# Altium schematic sheet Electron.SchDoc
size A3
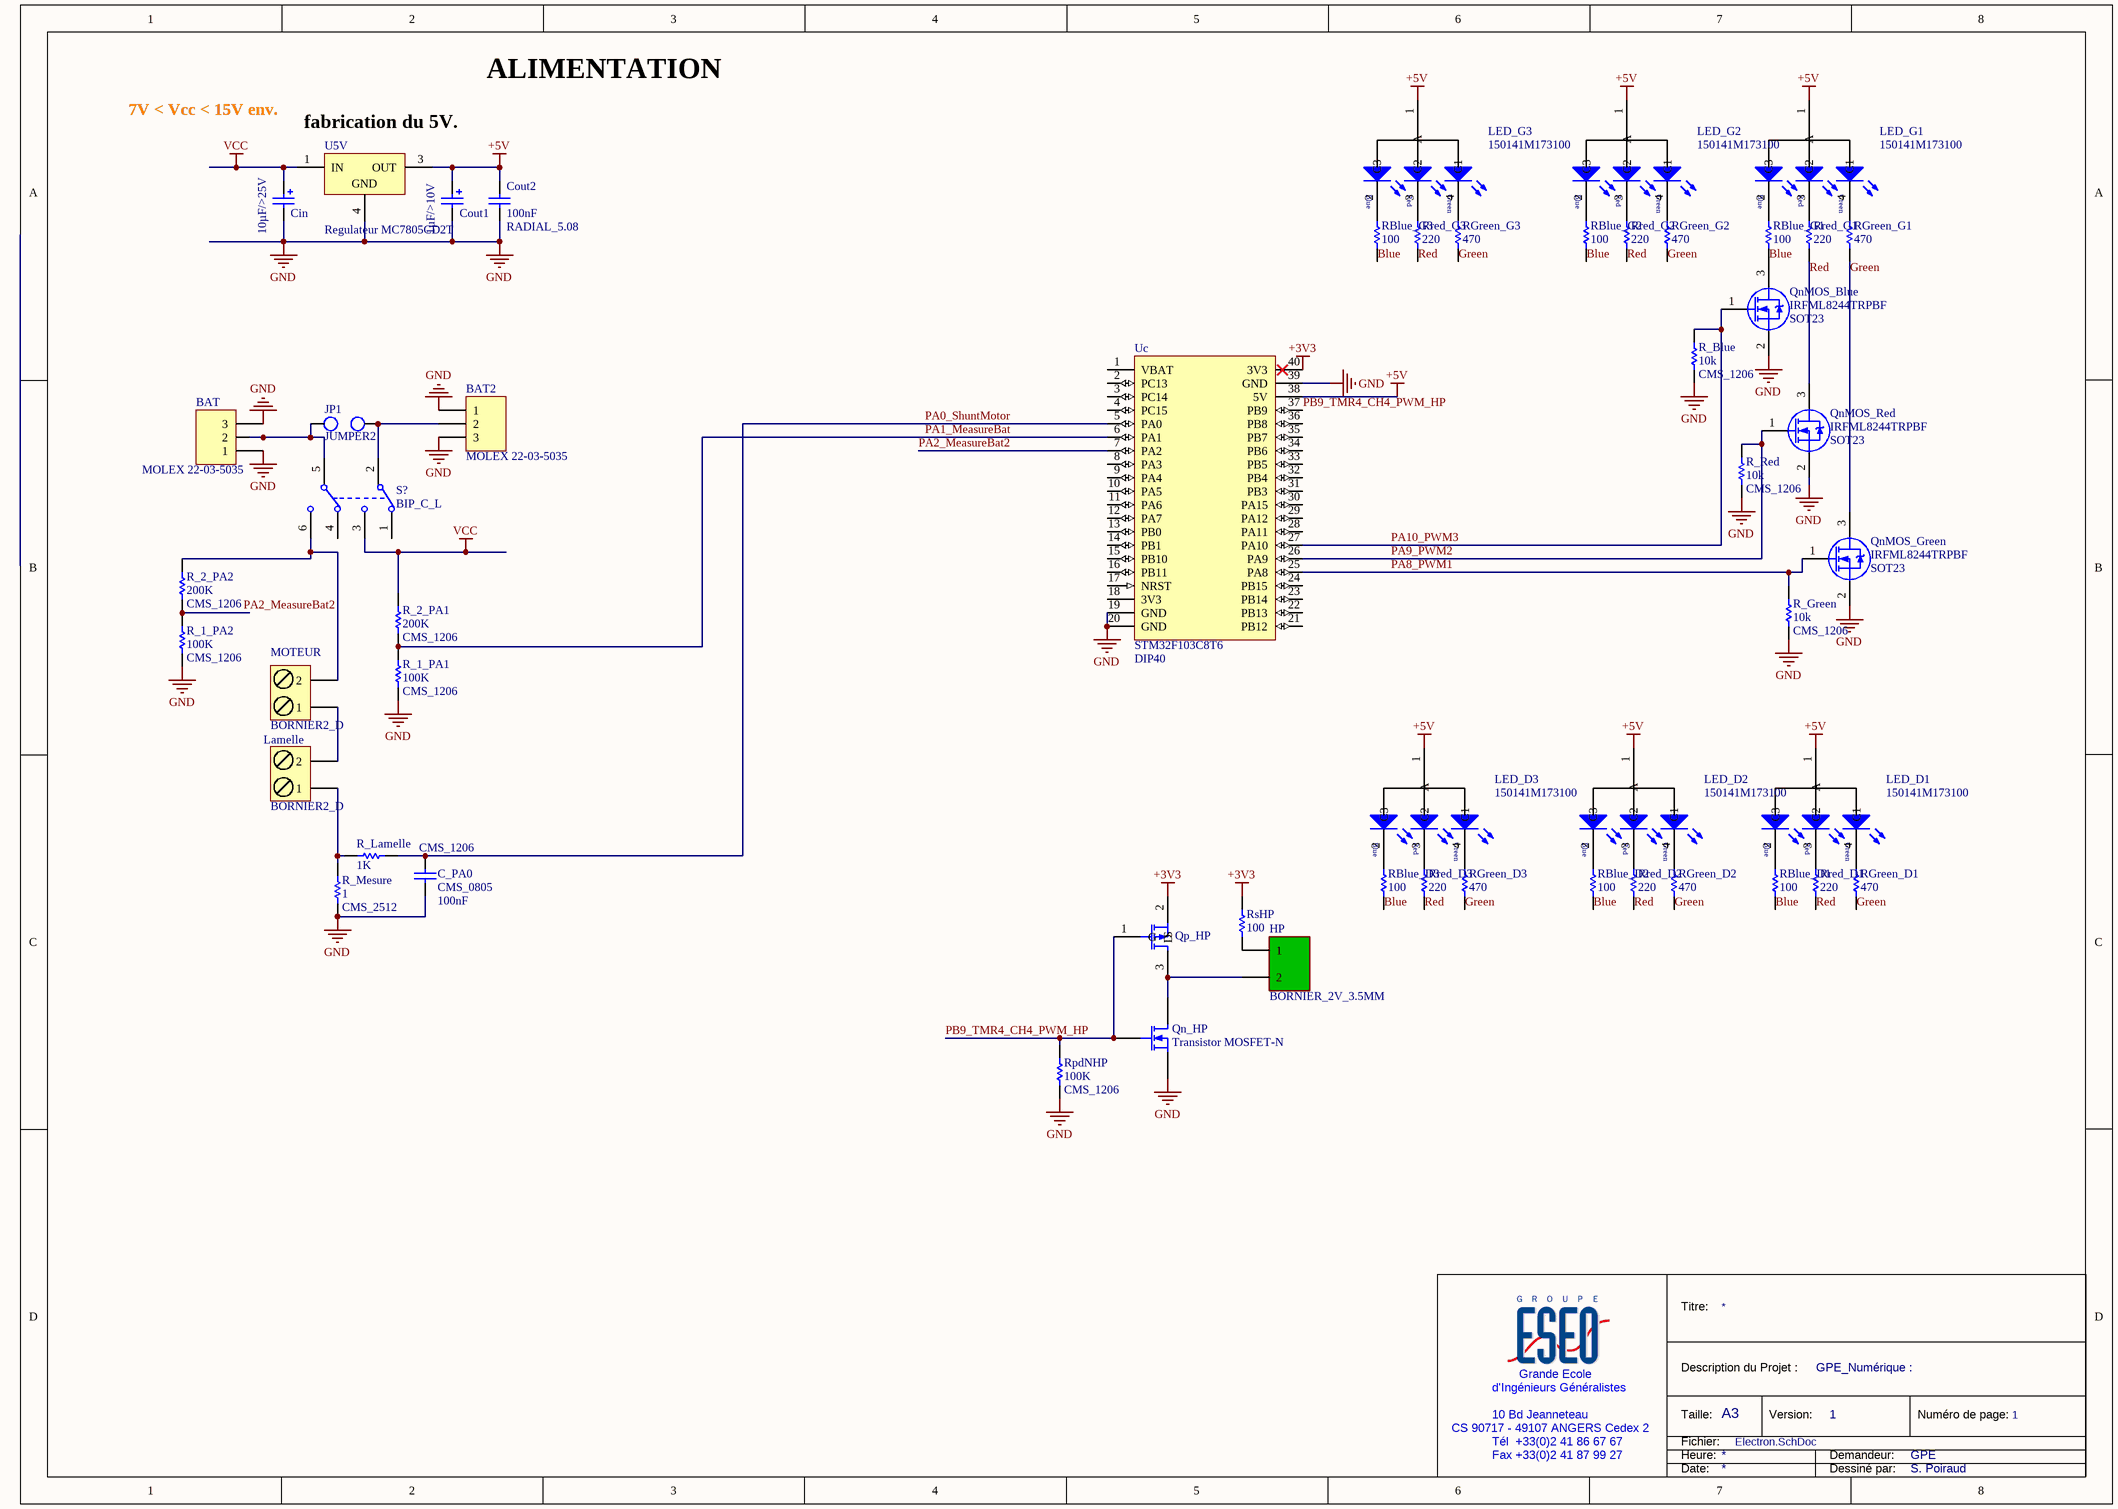
[diagram p0: Electron.SchDoc]

## Parts
BAT  MOLEX 22-03-5035  [MOLEX3_2.5MM]
BAT2  MOLEX 22-03-5035  [MOLEX3_2.5MM]
C_PA0  value 100nF  [C0805_N]  (hidden comment: CMS_0805)
Cin  value 10µF/>25V  [C1206_N]  (hidden comment: CONDENSATEUR_POL_ELECTROLY_RAD_2.0/5.08)
Cout1  value 1µF/>10V  [C1206_N]  (hidden comment: CONDENSATEUR_POL_ELECTROLY_RAD_2.0/5.08)
Cout2  value 100nF  Type: RADIAL_5.08  [C1206_N]  (hidden comment: CONDENSATEUR_CER_RAD_5.08)
HP  BORNIER_2V_3.5MM  [BORNIER_2V_3.5MM]
JP1  JUMPER2  [BARRETTE_2_M_D]
Lamelle  Type: BORNIER2_D  [BORNIER2_A_VIS]  (hidden comment: BORNIER2 DROIT A VIS)
LED_D1  150141M173100  [3528]
LED_D2  150141M173100  [3528]
LED_D3  150141M173100  [3528]
LED_G1  150141M173100  [3528]
LED_G2  150141M173100  [3528]
LED_G3  150141M173100  [3528]
MOTEUR  Type: BORNIER2_D  [BORNIER2_A_VIS]  (hidden comment: BORNIER2 DROIT A VIS)
Qn_HP  Transistor MOSFET-N  [SOT23-3N]
QnMOS_Blue  Type: IRFML8244TRPBF  Package: SOT23  [TRANSISTOR_MOSFET-N_SOT23_GSD]  (hidden comment: TRANSISTOR_MOSFET-N_SOT23_GSD)
QnMOS_Green  Type: IRFML8244TRPBF  Package: SOT23  [TRANSISTOR_MOSFET-N_SOT23_GSD]  (hidden comment: TRANSISTOR_MOSFET-N_SOT23_GSD)
QnMOS_Red  Type: IRFML8244TRPBF  Package: SOT23  [TRANSISTOR_MOSFET-N_SOT23_GSD]  (hidden comment: TRANSISTOR_MOSFET-N_SOT23_GSD)
Qp_HP  Transistor MOSFET-P  [SOT23-3N]  (value not drawn)
R_1_PA1  value 100K  Type: CMS_1206  [R1206_N]  (hidden comment: RESISTANCE_CMS_1206)
R_1_PA2  value 100K  Type: CMS_1206  [R1206_N]  (hidden comment: RESISTANCE_CMS_1206)
R_2_PA1  value 200K  Type: CMS_1206  [R1206_N]  (hidden comment: RESISTANCE_CMS_1206)
R_2_PA2  value 200K  Type: CMS_1206  [R1206_N]  (hidden comment: RESISTANCE_CMS_1206)
R_Blue  value 10k  Type: CMS_1206  [R1206_N]  (hidden comment: RESISTANCE_CMS_1206)
R_Green  value 10k  Type: CMS_1206  [R1206_N]  (hidden comment: RESISTANCE_CMS_1206)
R_Lamelle  value 1K  Type: CMS_1206  [R1206_N]  (hidden comment: RESISTANCE_CMS_1206)
R_Mesure  value 1  Type: CMS_2512  [INDUCTANCE_CMS_1812]  (hidden comment: RESISTANCE_CMS_1206)
R_Red  value 10k  Type: CMS_1206  [R1206_N]  (hidden comment: RESISTANCE_CMS_1206)
RBlue_D1  100  [R1206_N]
RBlue_D2  100  [R1206_N]
RBlue_D3  100  [R1206_N]
RBlue_G1  100  [R1206_N]
RBlue_G2  100  [R1206_N]
RBlue_G3  100  [R1206_N]
RGreen_D1  470  [R1206_N]
RGreen_D2  470  [R1206_N]
RGreen_D3  470  [R1206_N]
RGreen_G1  470  [R1206_N]
RGreen_G2  470  [R1206_N]
RGreen_G3  470  [R1206_N]
RpdNHP  value 100K  Type: CMS_1206  [R1206_N]  (hidden comment: RESISTANCE_CMS_1206)
Rred_D1  220  [R1206_N]
Rred_D2  220  [R1206_N]
Rred_D3  220  [R1206_N]
Rred_G1  220  [R1206_N]
Rred_G2  220  [R1206_N]
Rred_G3  220  [R1206_N]
RsHP  value 100  [R1206_N]  (hidden comment: RESISTANCE_CMS_1206)
S?  Type: BIP_C_L  [INTER_BIPOL_COUD_LEVIERGD]  (hidden comment: INTERRUPTEUR_BIPOLAIRE_COUDE_A_LEVIER)
U5V  Regulateur MC7805CD2T  [D2Pak (134)]
Uc  Type: STM32F103C8T6  Package: DIP40  [STM32F103C8T6_DIP40]  (hidden comment: STM32F103C8T6/PCB_DIP40)

## Nets
+3V3: Qp_HP.2(S) RsHP.2 Uc.40(3V3)
+5V: Cout1.1 Cout2.2 LED_D1.1(A) LED_D2.1(A) LED_D3.1(A) LED_G1.1(A) LED_G2.1(A) LED_G3.1(A) U5V.3(OUT) Uc.38(5V)
GND: BAT.1 BAT.3 BAT2.1 BAT2.3 C_PA0.1 Cin.2 Cout1.2 Cout2.1 Qn_HP.2(S) QnMOS_Blue.2(S) QnMOS_Green.2(S) QnMOS_Red.2(S) R_1_PA1.1 R_1_PA2.1 R_Blue.1 R_Green.2 R_Mesure.1 R_Red.2 RpdNHP.1 U5V.4(GND) Uc.19(GND) Uc.20(GND) Uc.39(GND)
VCC: Cin.1 R_2_PA1.2 S?.3 U5V.1(IN)
Blue: QnMOS_Blue.3(D) RBlue_D1.1 RBlue_D2.1 RBlue_D3.1 RBlue_G1.1 RBlue_G2.1 RBlue_G3.1
Green: QnMOS_Green.3(D) RGreen_D1.1 RGreen_D2.1 RGreen_D3.1 RGreen_G1.1 RGreen_G2.1 RGreen_G3.1
PA0_ShuntMotor: C_PA0.2 R_Lamelle.2 Uc.5(PA0)
PA1_MeasureBat: R_1_PA1.2 R_2_PA1.1 Uc.6(PA1)
PA2_MeasureBat2: R_1_PA2.2 R_2_PA2.1 Uc.7(PA2)
PA8_PWM1: QnMOS_Green.1(G) R_Green.1 Uc.25(PA8)
PA9_PWM2: QnMOS_Red.1(G) R_Red.1 Uc.26(PA9)
PA10_PWM3: QnMOS_Blue.1(G) R_Blue.2 Uc.27(PA10)
PB9_TMR4_CH4_PWM_HP: Qn_HP.1(G) Qp_HP.1(G) RpdNHP.2 Uc.37(PB9)
Red: QnMOS_Red.3(D) Rred_D1.1 Rred_D2.1 Rred_D3.1 Rred_G1.1 Rred_G2.1 Rred_G3.1
NetBAT2_2: BAT2.2 JP1.2 S?.2
NetBAT_2: BAT.2 JP1.1 S?.5
NetHP_1: HP.1 RsHP.1
NetHP_2: HP.2 Qn_HP.3(D) Qp_HP.3(D)
NetLamelle_1: Lamelle.1 R_Lamelle.1 R_Mesure.2
NetLamelle_2: Lamelle.2 MOTEUR.1
NetLED_D1_2: LED_D1.2(C3) RBlue_D1.2
NetLED_D1_3: LED_D1.3(C2) Rred_D1.2
NetLED_D1_4: LED_D1.4(C1) RGreen_D1.2
NetLED_D2_2: LED_D2.2(C3) RBlue_D2.2
NetLED_D2_3: LED_D2.3(C2) Rred_D2.2
NetLED_D2_4: LED_D2.4(C1) RGreen_D2.2
NetLED_D3_2: LED_D3.2(C3) RBlue_D3.2
NetLED_D3_3: LED_D3.3(C2) Rred_D3.2
NetLED_D3_4: LED_D3.4(C1) RGreen_D3.2
NetLED_G1_2: LED_G1.2(C3) RBlue_G1.2
NetLED_G1_3: LED_G1.3(C2) Rred_G1.2
NetLED_G1_4: LED_G1.4(C1) RGreen_G1.2
NetLED_G2_2: LED_G2.2(C3) RBlue_G2.2
NetLED_G2_3: LED_G2.3(C2) Rred_G2.2
NetLED_G2_4: LED_G2.4(C1) RGreen_G2.2
NetLED_G3_2: LED_G3.2(C3) RBlue_G3.2
NetLED_G3_3: LED_G3.3(C2) Rred_G3.2
NetLED_G3_4: LED_G3.4(C1) RGreen_G3.2
NetMOTEUR_2: MOTEUR.2 R_2_PA2.2 S?.6

Not connected (* = marked no-connect by the designer): S? 1 4; Uc 1(VBAT) 2(PC13) 3(PC14) 4(PC15) 8(PA3) 9(PA4) 10(PA5) 11(PA6) 12(PA7) 13(PB0) 14(PB1) 15(PB10) 16(PB11) 17(NRST) 18(3V3) 21(PB12) 22(PB13) 23(PB14) 24(PB15) 28(PA11) 29(PA12) 30(PA15) 31(PB3) 32(PB4) 33(PB5) 34(PB6) 35(PB7) 36(PB8)

## Notes on the sheet
- ALIMENTATION
- 7V < Vcc < 15V env.
- (near U5V) fabrication du 5V.
- Titre:
- d'Ingénieurs Généralistes
- Grande Ecole
- Description du Projet :
- GPE_Numérique :
- CS 90717 - 49107 ANGERS Cedex 2
- 10 Bd Jeanneteau
- Tél  +33(0)2 41 86 67 67
- Fax +33(0)2 41 87 99 27
- Taille:
- Heure:
- Fichier:
- A3
- Version:
- 1
- Demandeur:
- GPE
- Numéro de page:
- Date:
- Dessiné par:
- S. Poiraud
- (in symbol WL-SFTW 3528 150141M173100) Blue; Red; Green

## Library data of the parts
BAT BAT2 = BARRETTE3: Header, 3-Pin; LatestRevisionDate: 17-Jul-2002; LatestRevisionNote: Re-released for DXP Platform.; Publisher: Altium Limited
C_PA0 = CONDENSATEUR_CMS_CER_0805: CONDENSATEUR CMS CERAMIQUE 0805; Type: CMS_0805
Cin Cout1 = CONDENSATEUR_POL_ELECTROLY_RAD_2.0/5.08: CONDENSATEUR POLARISE ELECTROLYTIQUE RADIAL 2.0/5.08; Type: POL_RAD_2.0/5.08
Cout2 = CONDENSATEUR_CER_RAD_5.08: CONDENSATEUR TRAVERSANT CERAMIQUE RADIAL 5.08mm
JP1 = JUMPER2: BARRETTE 2 CONTACTS 1 RANGEE MALE DROITE; Type: JUMPER2
Lamelle MOTEUR = BORNIER2_DROIT_A VIS: BORNIER 2 PLOTS DROIT A VIS 5.08mm
LED_D1-LED_D3 LED_G1-LED_G3 = WL-SFTW 3528 150141M173100: SMD Full-Color Top LED, WL-SFTW, Red & Green & Blue; Manufacturer: Würth Elektronik eiSos GmbH; PartNo: 150141M173100; ComponentLink1Description: Manufacturer; ComponentLink1URL: http://www.we-online.de; Created by: Christin Otto; Created Date: June 2013; ComponentLink2Description: Datasheet; ComponentLink2URL: http://katalog.we-online.com/led/datasheet/150141M173100.pdf; Color: Red & Green & Blue
Qn_HP = Transistor MOSFET-N: N-Channel MOSFET; PackageDocument: 1995/1996; Published: 8-Jun-2000; LatestRevisionDate: 17-Jul-2002; LatestRevisionNote: Re-released for DXP Platform.; PackageReference: E3; Publisher: Altium Limited
QnMOS_Blue QnMOS_Green QnMOS_Red = TRANSISTOR_MOSFET-N_SOT23_GSD: TRANSISTOR MOSFET CANAL N BOITIER SOT23_GSD
Qp_HP = Transistor MOSFET-P: P-Channel MOSFET; PackageDocument: 1995/1996; Published: 8-Jun-2000; LatestRevisionDate: 17-Jul-2002; LatestRevisionNote: Re-released for DXP Platform.; PackageReference: E3; Publisher: Altium Limited
R_1_PA1 R_1_PA2 R_2_PA1 R_2_PA2 R_Blue R_Green R_Lamelle R_Mesure R_Red RpdNHP RsHP = RESISTANCE_CMS_1206: RESISTANCE CMS 1206
  RsHP: Type: CMS_1206
RBlue_D1-RBlue_D3 RBlue_G1-RBlue_G3 RGreen_D1-RGreen_D3 RGreen_G1-RGreen_G3 Rred_D1-Rred_D3 Rred_G1-Rred_G3 = Resistor: Published: 8-Jun-2000; LatestRevisionDate: 17-Jul-2002; LatestRevisionNote: Re-released for DXP Platform.; PackageReference: AXIAL-0.5; Publisher: Altium Limited
S? = INTERRUPTEUR_BIPOLAIRE_COUDE_A_LEVIER: INTERRUPTEUR BIPOLAIRE COUDE A LEVIER ON/ON
U5V = Regulateur MC7805CD2T: Three-Terminal Positive Voltage Regulator; Note: Pin 2 is electrically connected to Pin 4; Pin 2 is trimmed and not drawn;; Published: 15-Apr-2002; DatasheetVersion: 1997; PackageVersion: 1997; PackageReference: 936-03; Publisher: Altium Limited; PackageDescription: D2-PAK/TO-263-AB; 3 Leads (1 Cropped); Body 14.7 (inc. leads) x 10.2 mm (LxW max); ComponentLink1Description: Manufacturer Link; ComponentLink1URL: http://www.onsemi.com/site/products/taxonomy/0,4438,503,00.html; ComponentLink2Description: Datasheet; ComponentLink2URL: http://www.onsemi.com/pub/Collateral/MC7800-D.PDF
Uc = STM32F103C8T6/PCB_DIP40: MICROCONTROLEUR 32 BITS - 72MHz - 34 I/O - 64 KO : FLASH - 20KO RAM - 10 CANAUX A/D 12 BITS - DIP40 - UART, SPI, I2C, USB, CAN